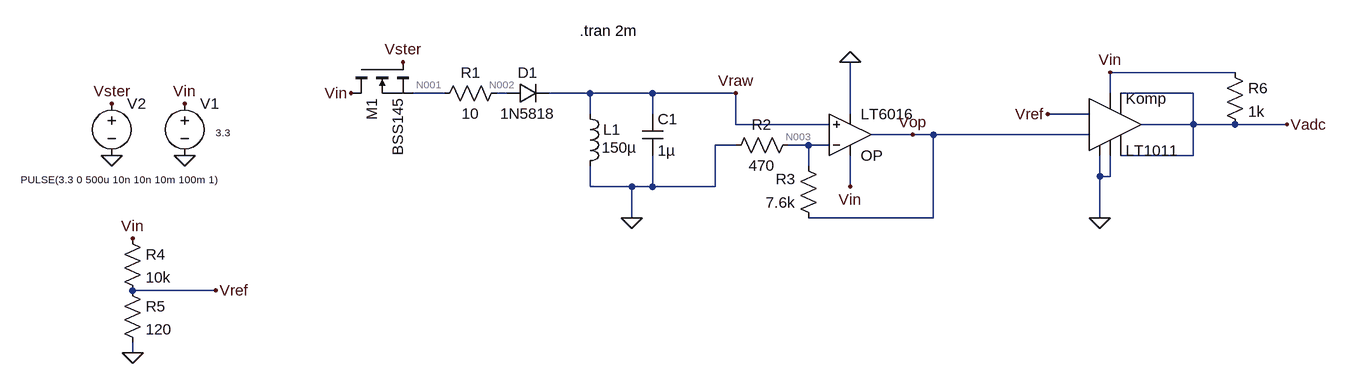
[diagram p0: schematic Draft2.asc]
* Draft2.asc
R1 N002 N001 10
D1 N002 Vraw 1N5818
L1 Vraw 0 150µ Ipk=0.26 Rser=0.86 Rpar=26100 Cpar=0 mfg="Bourns, Inc." pn="SRR4028-151Y"
C1 Vraw 0 1µ V=50 Irms=0 Rser=0.0428 Lser=1.15p mfg="Würth Elektronik" pn="885382208005 WCAP-CSST 1206" type="X7R"
V1 Vin 0 3.3
M1 Vin Vster N001 N001 BSS145
X§Komp 0 Vop Vref 0 Vadc Vadc Vadc Vin LT1011
* OP: LT6016 (symbol OpAmps\LT6016 not available, pins judged from their places): In+=Vraw In-=N003 V+=Vin V-=0 OUT=Vop
V2 Vster 0 PULSE(3.3 0 500u 10n 10n 10m 100m 1)
R2 N003 0 470
R3 Vop N003 7.6k
R4 Vin Vref 10k
R5 Vref 0 120
R6 Vin Vadc 1k
.model D D
.lib standard.dio
.model NMOS NMOS
.model PMOS PMOS
.lib standard.mos
.tran 2m
.lib LTC1.lib
.backanno
.end

* Results of the author's LTspice run, read from the files saved beside the schematic
* Operating Point, zero values left out:
*   V(n001) = 238.4 mV
*   V(n002) = 186.2 mV
*   V(n003) = 4.512 mV
*   V(vadc) = 3.186 V
*   V(vin) = 3.3 V
*   V(vop) = 77.14 mV
*   V(vraw) = 4.488 mV
*   V(vref) = 39.13 mV
*   V(vster) = 3.3 V
*   I(D1) = 5.219 mA
*   I(L1) = 5.219 mA
*   I(R1) = -5.219 mA
*   I(R2) = 9.6 µA
*   I(R3) = 9.557 µA
*   I(R4) = 326.1 µA
*   I(R5) = 326.1 µA
*   I(R6) = 113.8 µA
*   I(V1) = -7.611 mA
*   Id(M1) = 5.219 mA
*   Is(M1) = -5.219 mA
*   Ix(komp:1) = -5.533 µA
*   Ix(komp:2) = -21.39 nA
*   Ix(komp:3) = -21.42 nA
*   Ix(komp:4) = -1.742 mA
*   Ix(komp:5) = 56.88 µA
*   Ix(komp:6) = 56.88 µA
*   Ix(komp:7) = 3.039 nA
*   Ix(komp:8) = 1.634 mA
*   Ix(op:1) = -10.82 nA
*   Ix(op:2) = -43.38 nA
*   Ix(op:3) = 318.3 µA
*   Ix(op:4) = -308.8 µA
*   Ix(op:5) = -9.535 µA
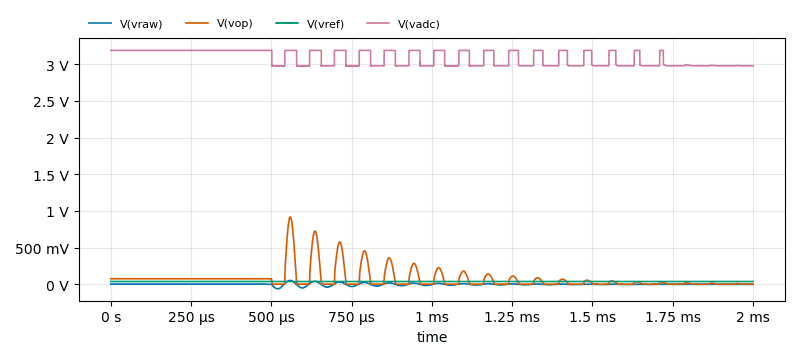
[diagram p1: Transient Analysis of Draft2.asc, plotted from the saved traces]
* Transient Analysis, 1 run:
*   V(vraw): min -60.21 mV, max 53.59 mV, average 728.6 µV, rms 13.15 mV, last -198.6 µV
*   V(vop): min 2.573 mV, max 918.5 mV, average 72.72 mV, rms 152.4 mV, last 2.683 mV
*   V(vref): min 39.13 mV, max 39.13 mV, average 39.13 mV, rms 39.13 mV, last 39.13 mV
*   V(vadc): min 2.969 V, max 3.187 V, average 3.079 V, rms 3.081 V, last 2.976 V